# EAGLE schematic s3-pilot1 (EAGLE 7.2.0)
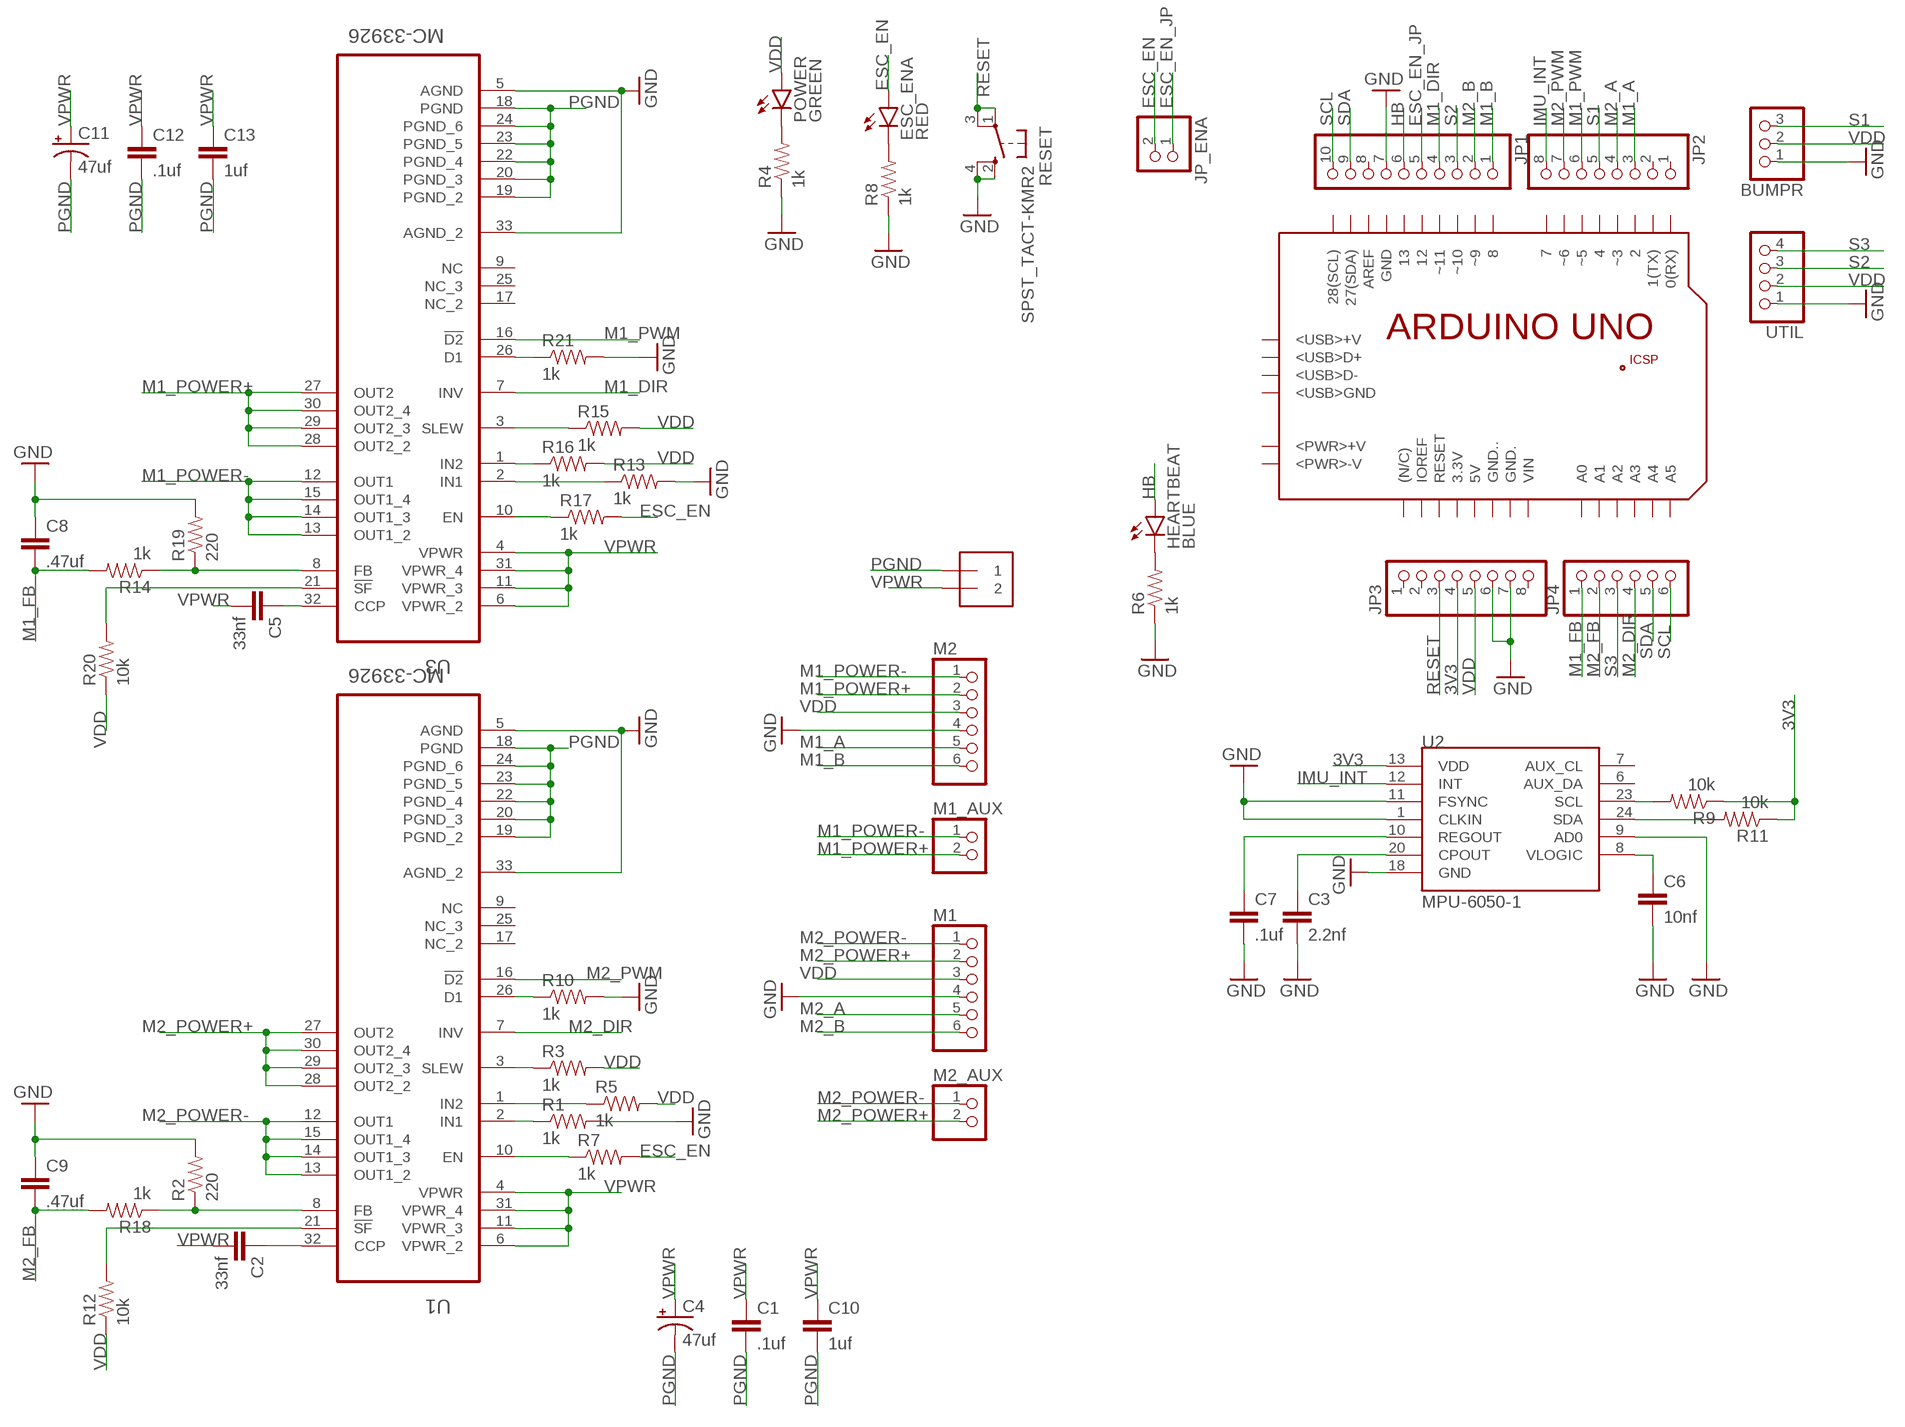
[diagram p0: schematic, sheet 1]

## Parts
BUMPR  PINHD-1X3/90  [1X03/90]
C1  .1uf  CAP0805  [0805]
C2  33nf  CAP0805  [0805]
C3  2.2nf  CAP0805  [0805]
C4  47uf  47UF-50V-20%(ELECT)  [PANASONIC_D]
C5  33nf  CAP0805  [0805]
C6  10nf  CAP0805  [0805]
C7  .1uf  CAP0805  [0805]
C8  .47uf  CAP0805  [0805]
C9  .47uf  CAP0805  [0805]
C10  1uf  CAP0805  [0805]
C11  47uf  47UF-50V-20%(ELECT)  [PANASONIC_D]
C12  .1uf  CAP0805  [0805]
C13  1uf  CAP0805  [0805]
ESC_ENA  RED  LED-RED0603  [LED-0603]
HEARTBEAT  BLUE  LED-BLUE0603  [LED-0603]
JP1  PINHD-1X10  [1X10]
JP2  PINHD-1X8  [1X08]
JP3  PINHD-1X8  [1X08]
JP4  PINHD-1X6  [1X06]
JP_ENA  PINHD-1X2  [1X02]
M1  PINHD-1X6/90  [1X06/90]
M1_AUX  PINHD-1X2/90  [1X02/90]
M2  PINHD-1X6/90  [1X06/90]
M2_AUX  PINHD-1X2/90  [1X02/90]
MOTOR_POWER_IN  1X2-3.5MM  [1X2-3.5MM]
PCB1  ARDUINO_UNO_EXT  (no package)
POWER  GREEN  LED-GREEN0603  [LED-0603]
R1  1k  RESISTOR0805-RES  [0805]
R2  220  RESISTOR0805-RES  [0805]
R3  1k  RESISTOR0805-RES  [0805]
R4  1k  RESISTOR0805-RES  [0805]
R5  1k  RESISTOR0805-RES  [0805]
R6  1k  RESISTOR0805-RES  [0805]
R7  1k  RESISTOR0805-RES  [0805]
R8  1k  RESISTOR0805-RES  [0805]
R9  10k  RESISTOR0805-RES  [0805]
R10  1k  RESISTOR0805-RES  [0805]
R11  10k  RESISTOR0805-RES  [0805]
R12  10k  RESISTOR0805-RES  [0805]
R13  1k  RESISTOR0805-RES  [0805]
R14  1k  RESISTOR0805-RES  [0805]
R15  1k  RESISTOR0805-RES  [0805]
R16  1k  RESISTOR0805-RES  [0805]
R17  1k  RESISTOR0805-RES  [0805]
R18  1k  RESISTOR0805-RES  [0805]
R19  220  RESISTOR0805-RES  [0805]
R20  10k  RESISTOR0805-RES  [0805]
R21  1k  RESISTOR0805-RES  [0805]
RESET  SPST_TACT-KMR2  [KMR2]
U1  MC-33926  FREESCALE-MC33926PNB  [QFN80P800X800X220-33N]
U2  MPU-6050-1  [QFN-24-4MM2]
U3  MC-33926  FREESCALE-MC33926PNB  [QFN80P800X800X220-33N]
UTIL  PINHD-1X4/90  [1X04/90]

## Nets
3V3 [Supply]: JP3.4 R9.1 R11.1 U2.13(VDD)
AGND [Supply]: U1.5(AGND) U1.33(AGND_2) ; supply symbol labelled GND
ESC_EN: ESC_ENA.A JP_ENA.2 R7.2 R17.2
ESC_EN_JP: JP1.5 JP_ENA.1
GND [Supply]: BUMPR.1 C3.2 C6.2 C7.2 C8.1 C9.1 JP1.7 JP3.6 JP3.7 M1.4 M2.4 R1.2 R2.2 R4.1 R6.1 R8.1 R10.2 R13.2 R19.2 R21.2 RESET.2(S) RESET.4(S1) U2.1(CLKIN) U2.9(AD0) U2.11(FSYNC) U2.18(GND) U3.5(AGND) U3.33(AGND_2) UTIL.1
HB: HEARTBEAT.A JP1.6
IMU_INT: JP2.8 U2.12(INT)
M1_A: JP2.3 M2.5
M1_B: JP1.1 M2.6
M1_DIR: JP1.4 U3.7(INV)
M1_FB: C8.2 JP4.1 R14.2
M1_POWER+ [MotorSupply]: M1_AUX.2 M2.2 U3.27(OUT2) U3.28(OUT2_2) U3.29(OUT2_3) U3.30(OUT2_4)
M1_POWER- [MotorSupply]: M1_AUX.1 M2.1 U3.12(OUT1) U3.13(OUT1_2) U3.14(OUT1_3) U3.15(OUT1_4)
M1_PWM: JP2.6 U3.16(!D2)
M2_A: JP2.4 M1.5
M2_B: JP1.2 M1.6
M2_DIR: JP4.4 U1.7(INV)
M2_FB: C9.2 JP4.2 R18.2
M2_POWER+ [MotorSupply]: M1.2 M2_AUX.2 U1.27(OUT2) U1.28(OUT2_2) U1.29(OUT2_3) U1.30(OUT2_4)
M2_POWER- [MotorSupply]: M1.1 M2_AUX.1 U1.12(OUT1) U1.13(OUT1_2) U1.14(OUT1_3) U1.15(OUT1_4)
M2_PWM: JP2.7 U1.16(!D2)
N$1: R17.1 U3.10(EN)
N$2: R10.1 U1.26(D1)
N$3: R3.1 U1.3(SLEW)
N$4: R15.1 U3.3(SLEW)
N$5: C5.1 U3.32(CCP)
N$6: C2.1 U1.32(CCP)
N$7: R7.1 U1.10(EN)
N$8: R5.1 U1.1(IN2)
N$9: R1.1 U1.2(IN1)
N$10: R16.1 U3.1(IN2)
N$11: R21.1 U3.26(D1)
N$12: R13.1 U3.2(IN1)
N$15: R12.2 U1.21(!SF)
N$16: R20.2 U3.21(!SF)
N$17: C3.1 U2.20(CPOUT)
N$18: C7.1 U2.10(REGOUT)
N$19: C6.1 U2.8(VLOGIC)
N$20: R2.1 R18.1 U1.8(FB)
N$21: POWER.C R4.2
N$22: R14.1 R19.1 U3.8(FB)
N$23: ESC_ENA.C R8.2
N$24: HEARTBEAT.C R6.2
PGND [MotorSupply]: C1.2 C4.- C10.2 C11.- C12.2 C13.2 MOTOR_POWER_IN.1 U1.18(PGND) U1.19(PGND_2) U1.20(PGND_3) U1.22(PGND_4) U1.23(PGND_5) U1.24(PGND_6) U3.18(PGND) U3.19(PGND_2) U3.20(PGND_3) U3.22(PGND_4) U3.23(PGND_5) U3.24(PGND_6)
RESET: JP3.3 RESET.1(P) RESET.3(P1)
S1: BUMPR.3 JP2.5
S2: JP1.3 UTIL.3
S3: JP4.3 UTIL.4
SCL: JP1.10 JP4.6 R9.2 U2.23(SCL)
SDA: JP1.9 JP4.5 R11.2 U2.24(SDA)
VDD [Supply]: BUMPR.2 JP3.5 M1.3 M2.3 POWER.A R3.2 R5.2 R12.1 R15.2 R16.2 R20.1 UTIL.2
VPWR [MotorSupply]: C1.1 C2.2 C4.+ C5.2 C10.1 C11.+ C12.1 C13.1 MOTOR_POWER_IN.2 U1.4(VPWR) U1.6(VPWR_2) U1.11(VPWR_3) U1.31(VPWR_4) U3.4(VPWR) U3.6(VPWR_2) U3.11(VPWR_3) U3.31(VPWR_4)
Unconnected: JP1.8 JP2.1 JP2.2 JP3.1 JP3.2 JP3.8 PCB1.0(RX) PCB1.1(TX) PCB1.2 PCB1.3.3V PCB1.4 PCB1.5V PCB1.7 PCB1.8 PCB1.12 PCB1.13 PCB1.27(SDA) PCB1.28(SCL) PCB1.(N/C) PCB1.+5V PCB1.<PWR>+V PCB1.<PWR>-V PCB1.<USB>+V PCB1.<USB>D+ PCB1.<USB>D- PCB1.<USB>GND PCB1.A0 PCB1.A1 PCB1.A2 PCB1.A3 PCB1.A4 PCB1.A5 PCB1.AREF PCB1.GND PCB1.GND. PCB1.GND.. PCB1.GND_ PCB1.IOREF PCB1.MISO PCB1.MOSI PCB1.RESET PCB1.RESET. PCB1.SCK PCB1.VIN PCB1.~3 PCB1.~5 PCB1.~6 PCB1.~9 PCB1.~10 PCB1.~11 U1.9(NC) U1.17(NC_2) U1.25(NC_3) U2.6(AUX_DA) U2.7(AUX_CL) U3.9(NC) U3.17(NC_2) U3.25(NC_3)

## Library data of the parts
BUMPR = pinhead:PINHD-1X3: PIN HEADER
C1 C2 C5 C8-C10 C12 C13 = Triple_Axis_Accelerometer-Gyro_Breakout_-_MPU-6050_v12:CAP: Capacitor Standard 0603 ceramic capacitor, and 0.1" leaded capacitor.
C3 C6 C7 = SparkFun-Passives:CAP: Capacitor Standard 0603 ceramic capacitor, and 0.1" leaded capacitor.
C4 C11 = SparkFun-Capacitors:47UF-50V-20%(ELECT): CAP-10547; PROD_ID: CAP-10547
ESC_ENA = SparkFun-LED:LED-RED: Assorted Red LEDs LilyPad 1206- DIO-09912 1206- DIO-00809 0603- DIO-00819; PROD_ID: DIO-00819
HEARTBEAT = SparkFun-LED:LED-BLUE: Blue LEDs for production use Various blue LEDs stocked by SparkFun production 0603 - DIO-08575 Rebel - DIO-09553 1206 - DIO-09911; PROD_ID: DIO-08575
JP1 = pinhead:PINHD-1X10: PIN HEADER
JP2 JP3 = pinhead:PINHD-1X8: PIN HEADER
JP4 M1 M2 = pinhead:PINHD-1X6: PIN HEADER
JP_ENA M1_AUX M2_AUX = pinhead:PINHD-1X2: PIN HEADER
MOTOR_POWER_IN = adafruit:1X2: 3.5mm Terminal block http://www.ladyada.net/library/pcb/eaglelibrary.html
PCB1 = E14_Arduino_published:ARDUINO_UNO_EXT: Device for representing an Arduino Uno board in an EAGLE design without the PCB footprint. Created by Dave Young for Element14. More EAGLE documentation at: http://www.element14.com/community/community/knode/cadsoft_eagle
POWER = SparkFun-LED:LED-GREEN: Various green LEDs Green LEDs used in SFE Production 0603- DIO-00821 LARGE- DIO-00862 LILYPAD- DIO-09910; PROD_ID: DIO-00821
R1-R21 = Triple_Axis_Accelerometer-Gyro_Breakout_-_MPU-6050_v12:RESISTOR: Resistor Basic schematic elements and footprints for 0603, 1206, and PTH resistors.
RESET = adafruit:SPST_TACT: SMT 6mm switch, EVQQ2 series http://www.ladyada.net/library/eagle
U1 U3 = Freescale-MC33926PNB:FREESCALE-MC33926PNB: AUTOMOTIVE THROTTLE H-BRIDGE ACTUATOR/ MOTOR EXCITER,QFN-32; MPN: MC33926PNB; OC_FARNELL: 2102575; OC_NEWARK: 40P5023; PACKAGE: QFN-32; SUPPLIER: Freescale
U2 = Triple_Axis_Accelerometer-Gyro_Breakout_-_MPU-6050_v12:MPU-6050
UTIL = pinhead:PINHD-1X4: PIN HEADER

## Net classes
0 Default: width 0.254 mm
1 Supply: width 0.508 mm
2 MotorSupply: width 1.016 mm